# EAGLE design photonAlarm4 (EAGLE 7.5.0)
CNAME: photon
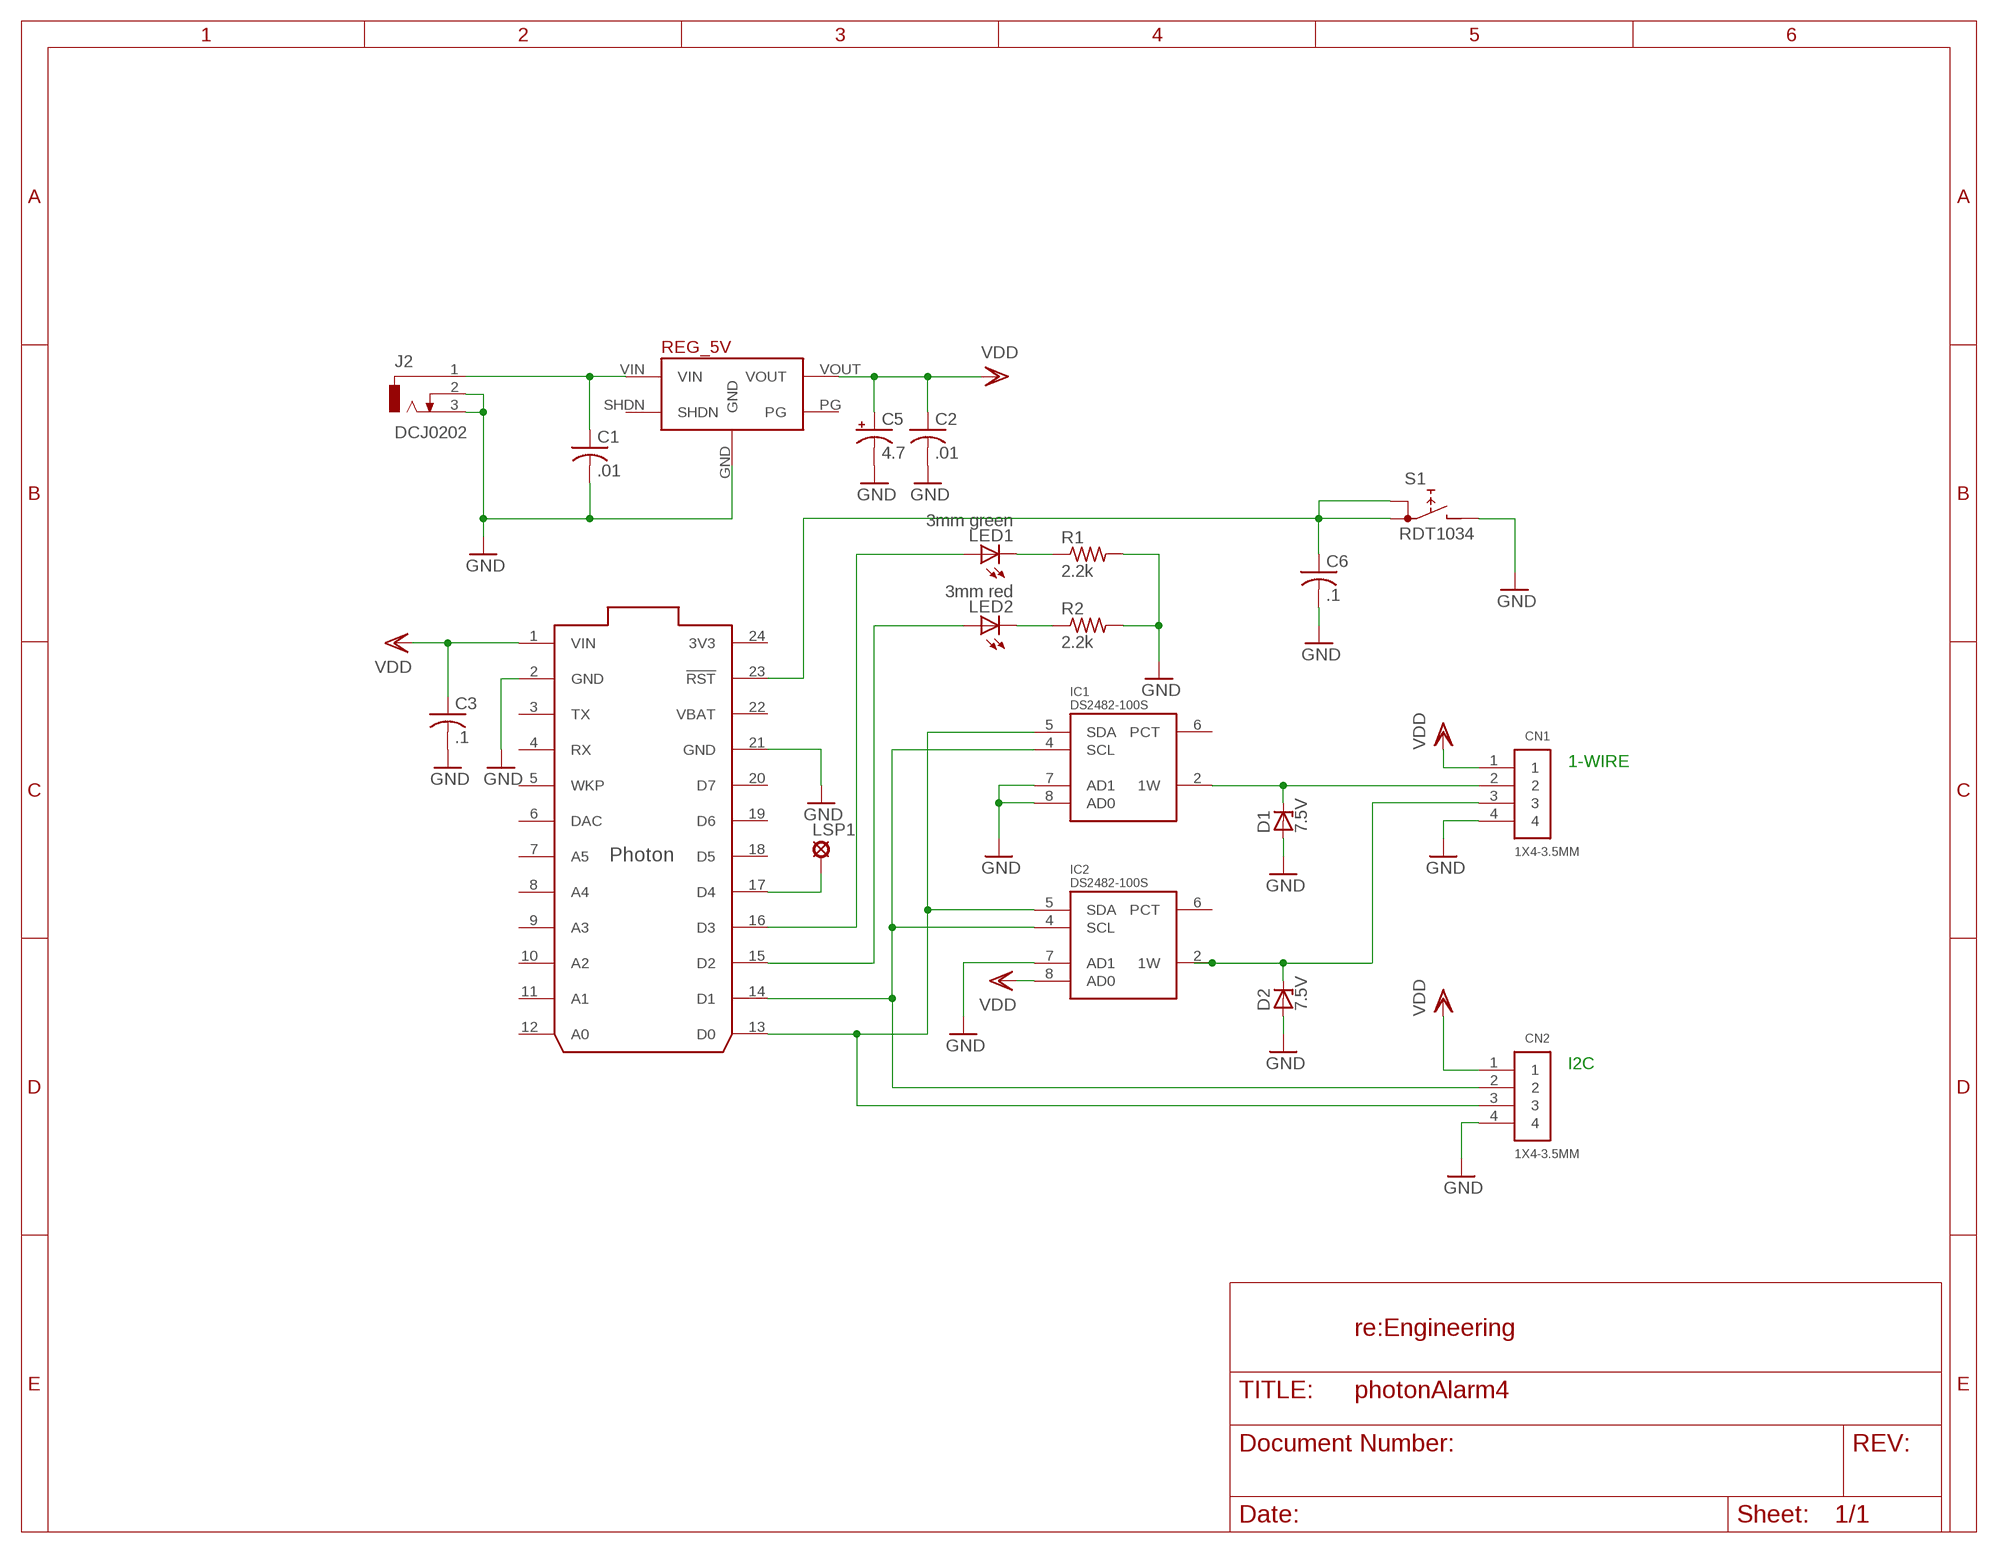
[diagram p0: schematic, sheet 1]

## Parts
C1  .01  C-USC0805  [C0805]
C2  .01  C-USC0805  [C0805]
C3  .1  C-USC0805  [C0805]
C5  4.7  CPOL-USE5-6  [E5-6]
C6  .1  C-USC0805  [C0805]
CN1  1X4-3.5MM  [1X04-3.5MM]
CN2  1X4-3.5MM  [1X04-3.5MM]
D1  7.5V  ZENER-DIODEZD-5  [ZDIO-5]
D2  7.5V  ZENER-DIODEZD-5  [ZDIO-5]
IC1  DS2482-100S  [SO08]
IC2  DS2482-100S  [SO08]
J2  DCJ0202  [DCJ0202]
LED1  3mm green  LED5MM  [LED5MM]
LED2  3mm red  LED5MM  [LED5MM]
LSP1  LSP10  [LSP10]
R1  2.2k  R-US_M0805  [M0805]
R2  2.2k  R-US_M0805  [M0805]
REG_5V  5V_D24V10FA  [5V_D24V10F5]
S1  RDT1034  [RDT1034]
U$1  PHOTON_WITH_HEADERS  [PHOTON]

## Nets
GND: C1.2 C2.2 C3.2 C5.- C6.2 CN1.4 CN2.4 D1.A D2.A IC1.7(AD1) IC1.8(AD0) IC2.7(AD1) J2.2 J2.3 R1.2 R2.2 REG_5V.GND S1.B U$1.2(GND) U$1.21(GND)
N$1: LSP1.MP U$1.17(D4)
N$2: CN2.2 IC1.4(SCL) IC2.4(SCL) U$1.14(D1)
N$3: LED1.K(C) R1.1
N$4: LED2.K(C) R2.1
N$5: LED1.A U$1.16(D3)
N$6: LED2.A U$1.15(D2)
N$7: CN2.3 IC1.5(SDA) IC2.5(SDA) U$1.13(D0)
N$8: CN1.2 D1.C IC1.2(1W)
N$11: CN1.3 D2.C IC2.2(1W)
N$15: C6.1 S1.A S1.A1 U$1.23(!RST)
VDD: C2.1 C3.1 C5.+ CN1.1 CN2.1 IC2.8(AD0) REG_5V.VOUT U$1.1(VIN)
VIN: C1.1 J2.1 REG_5V.VIN
Unconnected: IC1.6(PCT) IC2.6(PCT) REG_5V.PG REG_5V.SHDN U$1.3(TX) U$1.4(RX) U$1.5(WKP) U$1.6(DAC) U$1.7(A5) U$1.8(A4) U$1.9(A3) U$1.10(A2) U$1.11(A1) U$1.12(A0) U$1.18(D5) U$1.19(D6) U$1.20(D7)

## Notes on the sheet
- 1-WIRE
- I2C
- re:Engineering

## Power pins joined to a net without a drawn wire
3V3: U$1.24(3V3)
GND: IC1.3(GND) IC2.3(GND)
VBAT: U$1.22(VBAT)
VDD: IC1.1(VDD) IC2.1(VDD)

## Library data of the parts
C1-C3 C6 = adafruit:C-US: CAPACITOR, American symbol
C5 = rcl:CPOL-US: POLARIZED CAPACITOR, American symbol
CN1 CN2 = adafruit:1X4: 4-pin connector
D1 D2 = diode:ZENER-DIODE: Z-Diode
IC1 IC2 = 1wire:DS2482-100: I2C to 1-Wire Host Adapter/Line Driver This device is a onewire host and I2C interface in one chip. It provides the complete DC/AC requirements for onewire communication, including overdrive speed mode, but, unlike the DS2480B chip, no 12V EPROM programming. Notes: For overdrive speed and 5V EEPROM programming, an external active pullup circuit must be connected to the 1W, VDD and PCT pin. See the datasheet for details. The lower two I2C adress bits of the chip can be selected by external pins, so up to 4 chips may be connected to the same I2C bus. Author: Orginal device and description from Giovanni Varasano <giovanni.varasano@fastwebnet.it> Improved by Jan Kandziora <jjj@gmx.de>
J2 = con-jack:DCJ0202: DC POWER JACK Source: DCJ0202.pdf; OC_FARNELL: unknown; OC_NEWARK: unknown
LED1 LED2 = adafruit:LED: LED OSRAM: - CHIPLED LG R971, LG N971, LY N971, LG Q971, LY Q971, LO R971, LY R971 LH N974, LH R974 LS Q976, LO Q976, LY Q976 LO Q996 - Hyper CHIPLED LW Q18S LB Q993, LB Q99A, LB R99A - SideLED LS A670, LO A670, LY A670, LG A670, LP A670 LB A673, LV A673, LT A673, LW A673 LH A674 LY A675 LS A676, LA A676, LO A676, LY A676, LW A676 LS A679, LY A679, LG A679 - Hyper Micro SIDELED® LS Y876, LA Y876, LO Y876, LY Y876 LT Y87S - SmartLED LW L88C, LW L88S LB L89C, LB L89S, LG L890 LS L89K, LO L89K, LY L89K LS L896, LA L896, LO L896, LY L896 - TOPLED LS T670, LO T670, LY T670, LG T670, LP T670 LSG T670, LSP T670, LSY T670, LOP T670, LYG T670 LG T671, LOG T671, LSG T671 LB T673, LV T673, LT T673, LW T673 LH T674 LS T676, LA T676, LO T676, LY T676, LB T676, LH T676, LSB T676, LW T676 LB T67C, LV T67C, LT T67C, LS T67K, LO T67K, LY T67K, LW E67C LS E67B, LA E67B, LO E67B, LY E67B, LB E67C, LV E67C, LT E67C LW T67C LS T679, LY T679, LG T679 LS T770, LO T770, LY T770, LG T770, LP T770 LB T773, LV T773, LT T773, LW T773 LH T774 LS E675, LA E675, LY E675, LS T675 LS T776, LA T776, LO T776, LY T776, LB T776 LHGB T686 LT T68C, LB T68C - Hyper Mini TOPLED® LB M676 - Mini TOPLED Santana® LG M470 LS M47K, LO M47K, LY M47K Source: http://www.osram.convergy.de/
LSP1 = solpad:LSP10: SOLDER PAD drill 1.0 mm, distributor Buerklin, 12H555
R1 R2 = adafruit:R-US_: RESISTOR, American symbol
REG_5V = Pololu Voltage Regulators:5V_D24V10FA
S1 = switch:RDT1034: PUSH SWITCH www.radiohm.com
U$1 = Spark:PHOTON

## Board
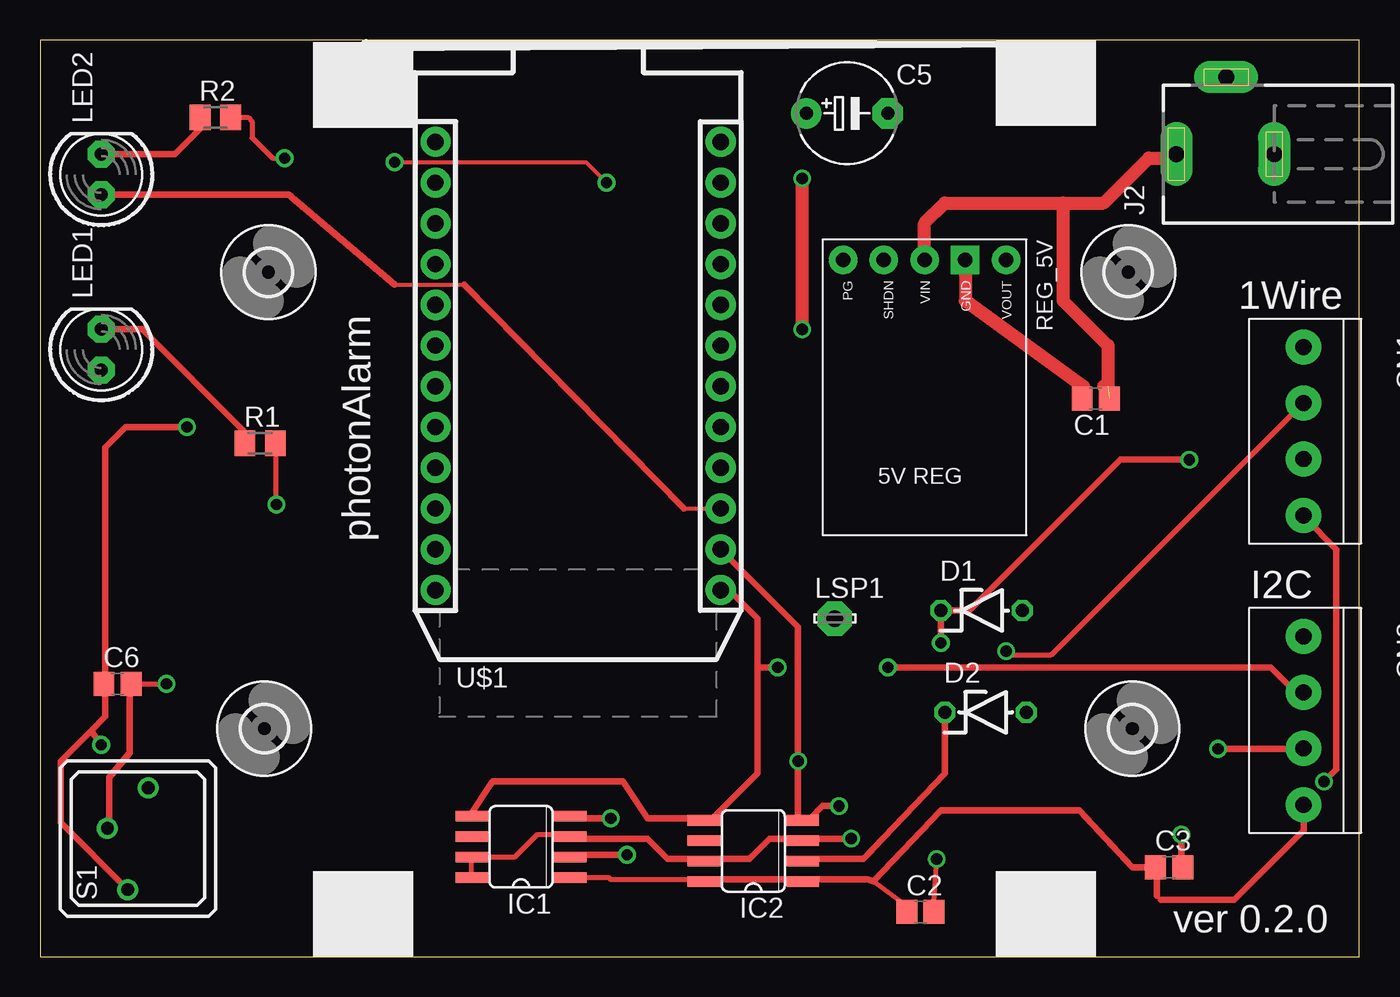
[diagram p1: board, top side]
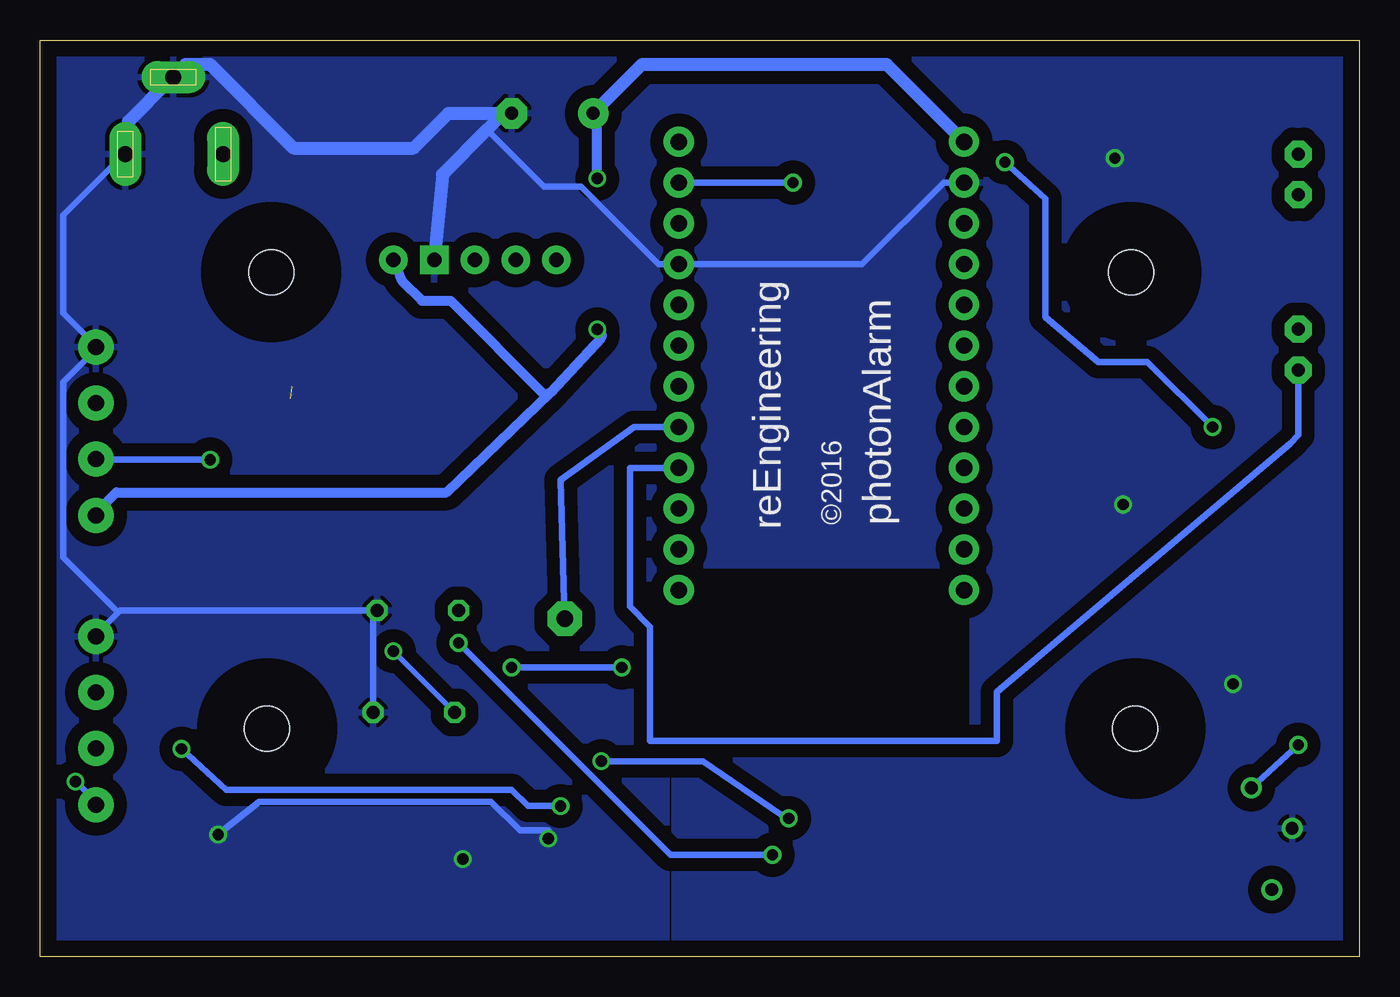
[diagram p2: board, bottom side, seen from below]

Size 82.22 x 57.14 mm. Coordinates in mm from the lower left corner, seen from the top.
Outline: 0,0 82.22,0 82.22,57.14 0,57.14 0,0
Copper layers (1*16): Top 0.035mm / dielectric 1.5mm / Bottom 0.035mm
Design rules "default": minimum track width 10mil, minimum drill 24mil, track to track 8mil, track to pad 8mil, pad to pad 8mil, via to via 8mil, smd to smd 8mil, copper to edge 40mil, drill to drill 8mil, minimum pad ring 10mil, minimum via ring 8mil, stop-mask expansion 4mil, vias tented up to drill 0mil, thermal gap 10mil

### Footprints (pad centres in the part's own frame; a part is rotated, then mirrored left to right if it is on the bottom)
C0805 = smd 1.3 x 1.5: 1 -0.85,0; 2 0.85,0
E5-6 = drill 0.813 pad 1.905: + -2.54,0 | drill 0.813 pad 1.905 octagon: - 2.54,0
1X04-3.5MM = drill 1 pad 2.184: 1 -5.25,0; 2 -1.75,0; 3 1.75,0; 4 5.25,0
ZDIO-5 = drill 0.813 octagon: A 2.54,0; C -2.54,0
SO08 = smd 0.66 x 2.032: 1 -1.905,-3.073; 2 -0.635,-3.073; 3 0.635,-3.073; 4 1.905,-3.073; 5 1.905,3.073; 6 0.635,3.073; 7 -0.635,3.073; 8 -1.905,3.073
DCJ0202 = drill 1 pad 2 long: 1 0,3.1; 2 4.8,0; 3 0,-3
LED5MM = drill 0.813 pad 1.676 octagon: A -1.27,0; K 1.27,0
LSP10 = drill 1.016 pad 2.159 octagon: MP 0,0
M0805 = smd 1.3 x 1.6: 1 -0.95,0; 2 0.95,0
5V_D24V10F5 = drill 0.9 pad 1.778 square: GND -2.54,-10.16 | drill 0.9 pad 1.778: PG 5.08,-10.16; SHDN 2.54,-10.16; VIN 0,-10.16; VOUT -5.08,-10.16
RDT1034 = drill 0.8: A 3.175,-0.635; A1 -3.175,0.635; B 0.65,1.9
PHOTON = drill 1.016 pad 1.88: 1 1.27,32.258; 2 1.27,29.718; 3 1.27,27.178; 4 1.27,24.638; 5 1.27,22.098; 6 1.27,19.558; 7 1.27,17.018; 8 1.27,14.478; 9 1.27,11.938; 10 1.27,9.398; 11 1.27,6.858; 12 1.27,4.318; 13 19.05,4.318; 14 19.05,6.858; 15 19.05,9.398; 16 19.05,11.938; 17 19.05,14.478; 18 19.05,17.018; 19 19.05,19.558; 20 19.05,22.098; 21 19.05,24.638; 22 19.05,27.178; 23 19.05,29.718; 24 19.05,32.258
2,8 = hole 2.8: 0,0

### Placement (x,y rotation side)
C1  65.79,34.8 180 top
C2  54.86,2.79 0 top
C3  70.36,5.59 0 top
C5  50.29,52.58 0 top
C6  4.83,17.02 0 top
CN1  78.74,32.77 90 top
CN2  78.74,14.73 90 top
D1  58.67,21.59 0 top
D2  58.93,15.24 0 top
IC1  29.97,6.86 90 top
IC2  44.45,6.6 90 top
J2  73.91,50.04 90 top
LED1  3.81,37.85 90 top
LED2  3.81,48.77 90 top
LSP1  49.53,21.08 0 top
R1  13.72,32 0 top
R2  10.92,52.32 0 top
REG_5V  55.12,33.27 180 top
S1  6.1,7.37 90 top
U$1  23.37,18.54 0 top
U$2  [2,8]  14.22,42.67 0 top
U$3  [2,8]  13.97,14.22 0 top
U$4  [2,8]  67.82,42.67 0 top
U$5  [2,8]  68.07,14.22 0 top

### Tracks (layer width: path | path; a pad name or v marks a point on that pad's centre or on a via)
GND  (via drill 0.7)
  Top 0.305: R2.2 12.95,52.32 13.21,52.07 13.21,51.05 14.48,49.78 v15.24,49.78 | R1.2 14.67,28.26 v14.73,28.19 | C6.2 v7.87,17.02 | IC1.8 IC1.7 29.59,6.22 30.99,7.62 32.92,7.62 IC1.3 | C2.2 55.71,3.39 v55.88,6.1
  Top 0.406: IC1.3 34.04,7.37 37.85,7.37 39.12,6.1 41.15,6.1 IC2.7 41.4,6.1 44.2,6.1 45.47,7.37 47.5,7.37 IC2.3 47.75,7.37 v50.55,7.37 | C6.2 5.59,17.02 5.59,12.7 4.32,11.18 4.32,8.13 S1.B | v71.12,7.62 71.12,5.59 C3.2 | 27.18,5.08 26.92,4.83 IC1.8
  Top 0.813: REG_5V.GND 57.66,40.89 65.02,35.56 65.02,34.8 C1.2
  Bottom 0.406: 54.36,51.56 50.8,48.01 48.51,48.01 43.69,43.18 U$1.21 30.99,43.18 25.91,48.26 U$1.2 | 61.47,21.59 77.22,21.59 77.34,21.46 | 77.34,21.46 78.74,20.07 CN2.4 | 61.47,21.59 D2.A | 61.47,21.59 D1.A | J2.3 77.22,49.78 80.77,46.23 80.77,40.13 78.74,38.1 CN1.4 78.74,37.85 80.77,35.81 80.77,24.89 77.34,21.46 | v71.12,7.62 68.58,9.65 54.1,9.65 52.32,7.87 50.55,7.87 v50.55,7.37
  Bottom 0.813: REG_5V.GND 57.15,48.77 54.36,51.56 53.34,52.58 C5.- 56.77,52.58 58.93,50.42 66.42,50.42 71.63,55.63 73.15,55.63 73.91,54.86 J2.2 74.17,54.61 76.71,52.07 76.71,50.04 J2.3
  pour Bottom (isolate 0.813): 0.76,56.64 81.79,56.64 81.79,0.51 43.18,0.25 43.18,24.38 24.13,24.38 24.13,13.72 42.67,13.72 42.67,0.25 0.51,0.25
N$1
  Bottom 0.406: LSP1.MP 49.78,29.72 45.21,33.02 U$1.17
N$2  (via drill 0.7)
  Top 0.406: v35.56,8.64 33.53,8.64 IC1.4 | U$1.14 47.24,20.57 v47.24,12.19 47.24,8.64 47.5,8.38 IC2.4 47.5,8.64 48.01,8.64 48.77,9.4 v49.78,9.4 | v73.41,12.95 78.74,12.95 CN2.2
  Bottom 0.406: v47.24,12.19 40.89,12.19 36.07,8.89 v35.56,8.64 | v73.41,12.95 70.61,10.41 52.83,10.41 51.82,9.4 v49.78,9.4
N$3
  Top 0.406: LED1.K 6.35,39.12 12.7,32.77 12.7,32 R1.1
N$4
  Top 0.406: LED2.K 8.38,50.04 9.91,51.56 9.91,52.32 R2.1
N$5
  Bottom 0.406: LED1.A 3.81,32.51 4.32,32 22.61,16.51 22.61,13.46 44.2,13.46 44.2,20.57 45.47,21.84 45.47,30.48 U$1.16
N$6
  Top 0.254: 40.13,27.94 U$1.15 | 22.1,41.91 26.42,41.91
  Top 0.406: 26.42,41.91 40.13,27.94 | 22.1,41.91 15.49,47.5 LED2.A
N$7  (via drill 0.7)
  Top 0.406: IC1.5 26.67,8.64 28.19,10.92 36.32,10.92 37.85,8.64 41.15,8.64 IC2.5 41.4,8.64 41.91,8.64 44.7,11.43 44.7,18.03 | 44.7,18.03 44.7,21.08 42.93,22.86 U$1.13 | v52.83,18.03 76.71,18.03 78.23,16.51 78.74,16.51 CN2.3 | v45.97,18.03 44.7,18.03
  Bottom 0.406: v52.83,18.03 v45.97,18.03
N$8  (via drill 0.7)
  Top 0.406: v71.63,30.99 67.31,30.99 57.91,21.59 D1.C v56.13,19.56 | v36.58,6.35 33.53,6.35 33.27,6.1 33.27,6.35 IC1.2
  Bottom 0.406: v71.63,30.99 78.74,30.99 CN1.2 | v56.13,19.56 42.93,6.35 v36.58,6.35
N$11  (via drill 0.7)
  Top 0.305: v60.2,19.05 60.45,18.8 62.99,18.8 78.74,34.54 CN1.3
  Top 0.406: 51.31,6.1 51.82,6.6 | 51.31,6.1 47.75,6.1 IC2.2 | 51.31,6.1 56.39,11.43 D2.C
  Bottom 0.305: v60.2,19.05 D2.C
N$15  (via drill 0.7)
  Top 0.254: v35.31,48.26 34.04,49.53 v22.1,49.53
  Top 0.406: S1.A1 1.27,8.38 1.27,12.19 3.17,14.1 | 3.17,14.1 4.06,14.99 4.06,17.02 | v3.81,13.21 3.17,14.1 | 4.06,17.02 4.06,31.75 5.33,33.02 v9.14,33.02 | 4.06,17.02 C6.1
  Bottom 0.406: S1.A v3.81,13.21 | v9.14,33.02 13.21,37.08 16.26,37.08 19.56,39.88 19.56,47.24 v22.1,49.53 | v35.31,48.26 U$1.23
VDD  (via drill 0.7)
  Top 0.254: 69.6,3.81 69.85,3.56 | 69.6,5.59 C3.1
  Top 0.305: IC1.1 35.43,4.95 35.56,4.83 41.25,4.83 IC2.8 | C2.1 54.01,3.14 51.94,4.7
  Top 0.406: v80.01,10.92 80.77,11.68 80.77,25.4 78.74,27.43 CN1.1 | C3.1 68.07,5.59 64.77,9.14 56.13,9.14 51.94,4.7 51.56,4.83 47.75,4.83 IC2.1 47.5,4.83 41.4,4.83 IC2.8 | 69.6,5.59 69.6,3.81 | 69.85,3.56 74.42,3.56 78.74,7.87 CN2.1
  Top 0.813: v47.5,39.12 v47.5,48.51
  Bottom 0.406: v80.01,10.92 78.74,9.65 CN2.1
  Bottom 0.61: CN1.1 78.74,27.69 77.47,28.96 56.9,28.96 50.42,35.18 | 50.42,35.18 47.24,38.61 47.24,38.86 v47.5,39.12 | v47.5,48.51 47.5,52.32 C5.+ | REG_5V.VOUT 59.69,42.16 58.42,40.89 56.64,40.89 50.8,35.05 50.42,35.18
  Bottom 0.813: U$1.1 29.46,55.63 44.7,55.63 C5.+
VIN  (1 unrouted)
  Top 0.813: REG_5V.VIN 55.12,45.72 56.39,46.99 63.75,46.99 | 63.75,46.99 66.29,46.99 69.09,49.78 70.56,49.78 J2.1 | 66.29,35.56 66.55,35.56 66.55,38.1 63.75,40.89 63.75,46.99

### Text on the board
tNames: 1Wire | photonAlarm | I2C | ver 0.2.0
bNames: photonAlarm | ©2016 | reEngineering